# Altium schematic sheet muxes.SCHDOC: 8+2 Acquisition Board
size B; Engineer: Eric Jonas (jonas@mwl.mit.edu); Organization: PILM, MIT; Address1: 46-5227; Address2: 43 Vassar St.; Address3: Cambridge, MA 02139; Address4: Australia 2086
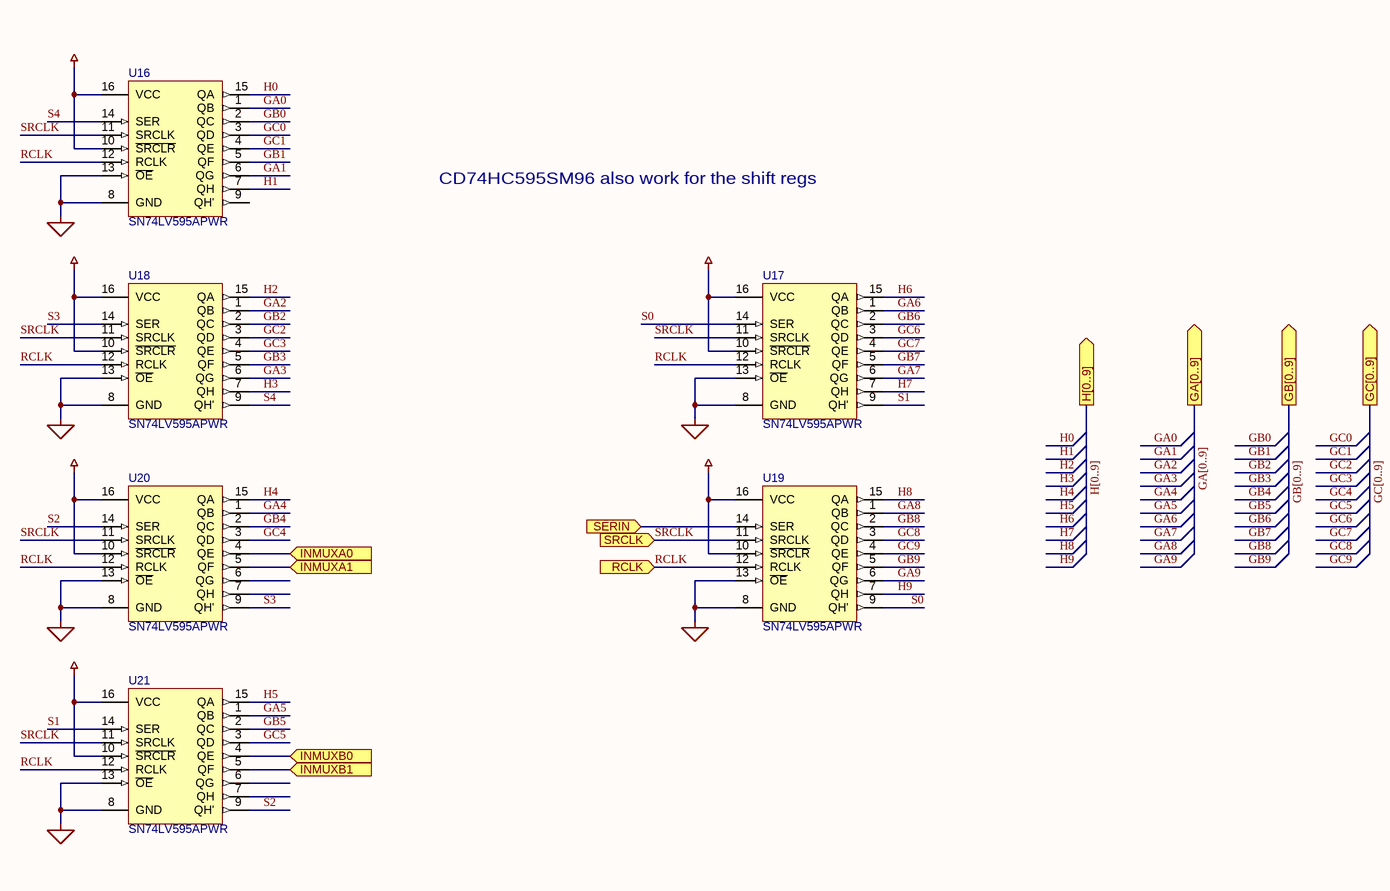
[diagram p0: muxes.SCHDOC]

## Parts
U16  SN74LV595APWR  [SSO-G16/X.4]
U17  SN74LV595APWR  [SSO-G16/X.4]
U18  SN74LV595APWR  [SSO-G16/X.4]
U19  SN74LV595APWR  [SSO-G16/X.4]
U20  SN74LV595APWR  [SSO-G16/X.4]
U21  SN74LV595APWR  [SSO-G16/X.4]

## Ports
GA[0..9] (out), GB[0..9] (out), GC[0..9] (out), H[0..9] (out), INMUXA0 (in), INMUXA1 (in), INMUXB0 (in), INMUXB1 (in), RCLK (in), SERIN (in), SRCLK (in)

## Nets
AGND: U16.8(GND) U16.13(~{OE}) U17.8(GND) U17.13(~{OE}) U18.8(GND) U18.13(~{OE}) U19.8(GND) U19.13(~{OE}) U20.8(GND) U20.13(~{OE}) U21.8(GND) U21.13(~{OE})
AVDD: U16.10(~{SRCLR}) U16.16(VCC) U17.10(~{SRCLR}) U17.16(VCC) U18.10(~{SRCLR}) U18.16(VCC) U19.10(~{SRCLR}) U19.16(VCC) U20.10(~{SRCLR}) U20.16(VCC) U21.10(~{SRCLR}) U21.16(VCC)
GA0: U16.1(QB)
GA1: U16.6(QG)
GA2: U18.1(QB)
GA3: U18.6(QG)
GA4: U20.1(QB)
GA5: U21.1(QB)
GA6: U17.1(QB)
GA7: U17.6(QG)
GA8: U19.1(QB)
GA9: U19.6(QG)
GB0: U16.2(QC)
GB1: U16.5(QF)
GB2: U18.2(QC)
GB3: U18.5(QF)
GB4: U20.2(QC)
GB5: U21.2(QC)
GB6: U17.2(QC)
GB7: U17.5(QF)
GB8: U19.2(QC)
GB9: U19.5(QF)
GC0: U16.3(QD)
GC1: U16.4(QE)
GC2: U18.3(QD)
GC3: U18.4(QE)
GC4: U20.3(QD)
GC5: U21.3(QD)
GC6: U17.3(QD)
GC7: U17.4(QE)
GC8: U19.3(QD)
GC9: U19.4(QE)
H0: U16.15(QA)
H1: U16.7(QH)
H2: U18.15(QA)
H3: U18.7(QH)
H4: U20.15(QA)
H5: U21.15(QA)
H6: U17.15(QA)
H7: U17.7(QH)
H8: U19.15(QA)
H9: U19.7(QH)
INMUXA0: U20.4(QE) ; port INMUXA0
INMUXA1: U20.5(QF) ; port INMUXA1
INMUXB0: U21.4(QE) ; port INMUXB0
INMUXB1: U21.5(QF) ; port INMUXB1
RCLK: U16.12(RCLK) U17.12(RCLK) U18.12(RCLK) U19.12(RCLK) U20.12(RCLK) U21.12(RCLK) ; port RCLK
S0: U17.14(SER) U19.9(QH')
S1: U17.9(QH') U21.14(SER)
S2: U20.14(SER) U21.9(QH')
S3: U18.14(SER) U20.9(QH')
S4: U16.14(SER) U18.9(QH')
SERIN: U19.14(SER) ; port SERIN
SRCLK: U16.11(SRCLK) U17.11(SRCLK) U18.11(SRCLK) U19.11(SRCLK) U20.11(SRCLK) U21.11(SRCLK) ; port SRCLK

Not connected (* = marked no-connect by the designer): U16 9(QH'); U20 6(QG) 7(QH); U21 6(QG) 7(QH)

## Buses and harness runs
bus GA[0..9] = port GA[0..9]
bus GB[0..9] = port GB[0..9]
bus GC[0..9] = port GC[0..9]
bus H[0..9] = port H[0..9]

## Notes on the sheet
- CD74HC595SM96 also work for the shift regs
- Title:
- Engineer:
- Date:
- Revision:
- Sheet
- of
- File:

## Library data of the parts
U16-U21 = SN74LV595APWR: 8-bit shift register with 3-state output; Vendor: Texas Instruments